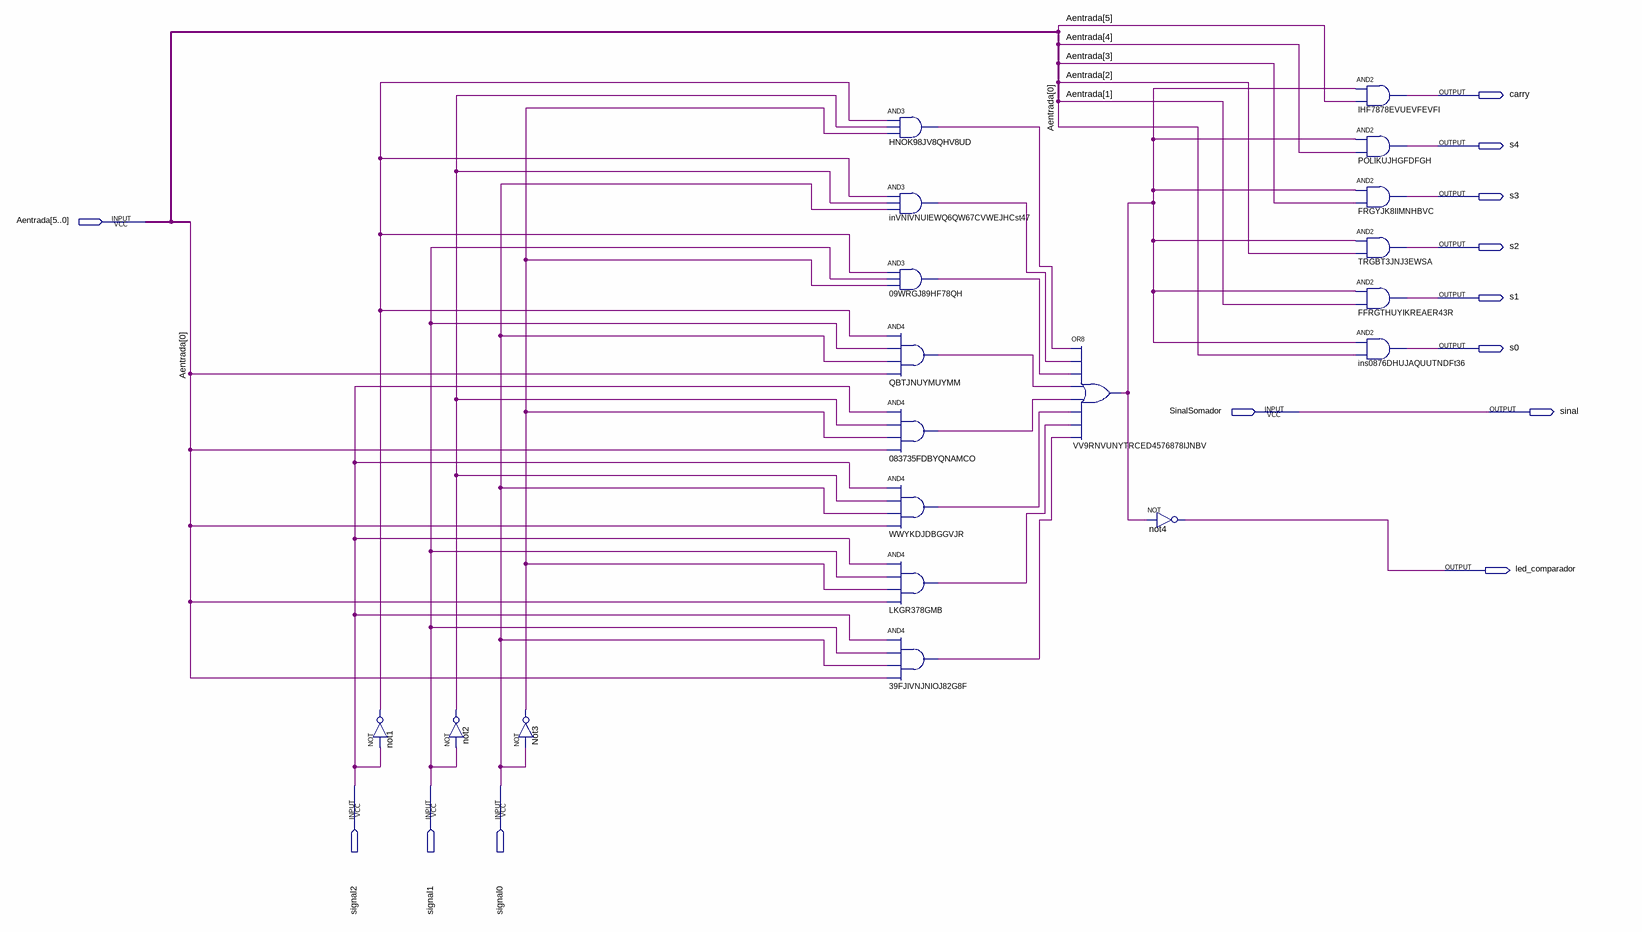
[diagram p0: schematic sheet]
// Quartus schematic LED.bdf as structural Verilog: 19 symbols, 13 pins
module LED (
  input  [5:0] Aentrada,
  input  SinalSomador,
  input  signal2,
  input  signal1,
  input  signal0,
  output carry,
  output s4,
  output s3,
  output s2,
  output s1,
  output s0,
  output sinal,
  output led_comparador
);

  wire HNOK98JV8QHV8UD_out, inVNIVNUIEWQ6QW67CVWEJHCst47_out, LKGR378GMB_out, n09WRGJ89HF78QH_out,
       n39FJIVNJNIOJ82G8F_out, n083735FDBYQNAMCO_out, not1_out, not2_out, Not3_out, QBTJNUYMUYMM_out,
       VV9RNVUNYTRCED4576878IJNBV_out, WWYKDJDBGGVJR_out;

  not not1 (not1_out, signal2);
  not not2 (not2_out, signal1);
  not Not3 (Not3_out, signal0);
  and HNOK98JV8QHV8UD (HNOK98JV8QHV8UD_out, not1_out, not2_out, Not3_out);
  and inVNIVNUIEWQ6QW67CVWEJHCst47 (inVNIVNUIEWQ6QW67CVWEJHCst47_out, not1_out, not2_out, signal0);
  and u_09WRGJ89HF78QH (n09WRGJ89HF78QH_out, not1_out, signal1, Not3_out);
  and QBTJNUYMUYMM (QBTJNUYMUYMM_out, not1_out, signal1, signal0, Aentrada[0]);
  and u_083735FDBYQNAMCO (n083735FDBYQNAMCO_out, signal2, not2_out, Not3_out, Aentrada[0]);
  and WWYKDJDBGGVJR (WWYKDJDBGGVJR_out, signal2, not2_out, signal0, Aentrada[0]);
  and LKGR378GMB (LKGR378GMB_out, signal2, signal1, Not3_out, Aentrada[0]);
  and u_39FJIVNJNIOJ82G8F (n39FJIVNJNIOJ82G8F_out, signal2, signal1, signal0, Aentrada[0]);
  or VV9RNVUNYTRCED4576878IJNBV (VV9RNVUNYTRCED4576878IJNBV_out, HNOK98JV8QHV8UD_out, inVNIVNUIEWQ6QW67CVWEJHCst47_out, n09WRGJ89HF78QH_out, QBTJNUYMUYMM_out, n083735FDBYQNAMCO_out, WWYKDJDBGGVJR_out, LKGR378GMB_out, n39FJIVNJNIOJ82G8F_out);
  not not4 (led_comparador, VV9RNVUNYTRCED4576878IJNBV_out);
  and IHF7878EVUEVFEVFI (carry, VV9RNVUNYTRCED4576878IJNBV_out, Aentrada[5]);
  and POLIKUJHGFDFGH (s4, VV9RNVUNYTRCED4576878IJNBV_out, Aentrada[4]);
  and FRGYJK8IIMNHBVC (s3, VV9RNVUNYTRCED4576878IJNBV_out, Aentrada[3]);
  and TRGBT3JNJ3EWSA (s2, VV9RNVUNYTRCED4576878IJNBV_out, Aentrada[2]);
  and FFRGTHUYIKREAER43R (s1, VV9RNVUNYTRCED4576878IJNBV_out, Aentrada[1]);
  and ins0876DHUJAQUUTNDFt36 (s0, VV9RNVUNYTRCED4576878IJNBV_out, Aentrada[0]);

  assign sinal = SinalSomador;
endmodule
